# Altium project Grace.PrjPcb
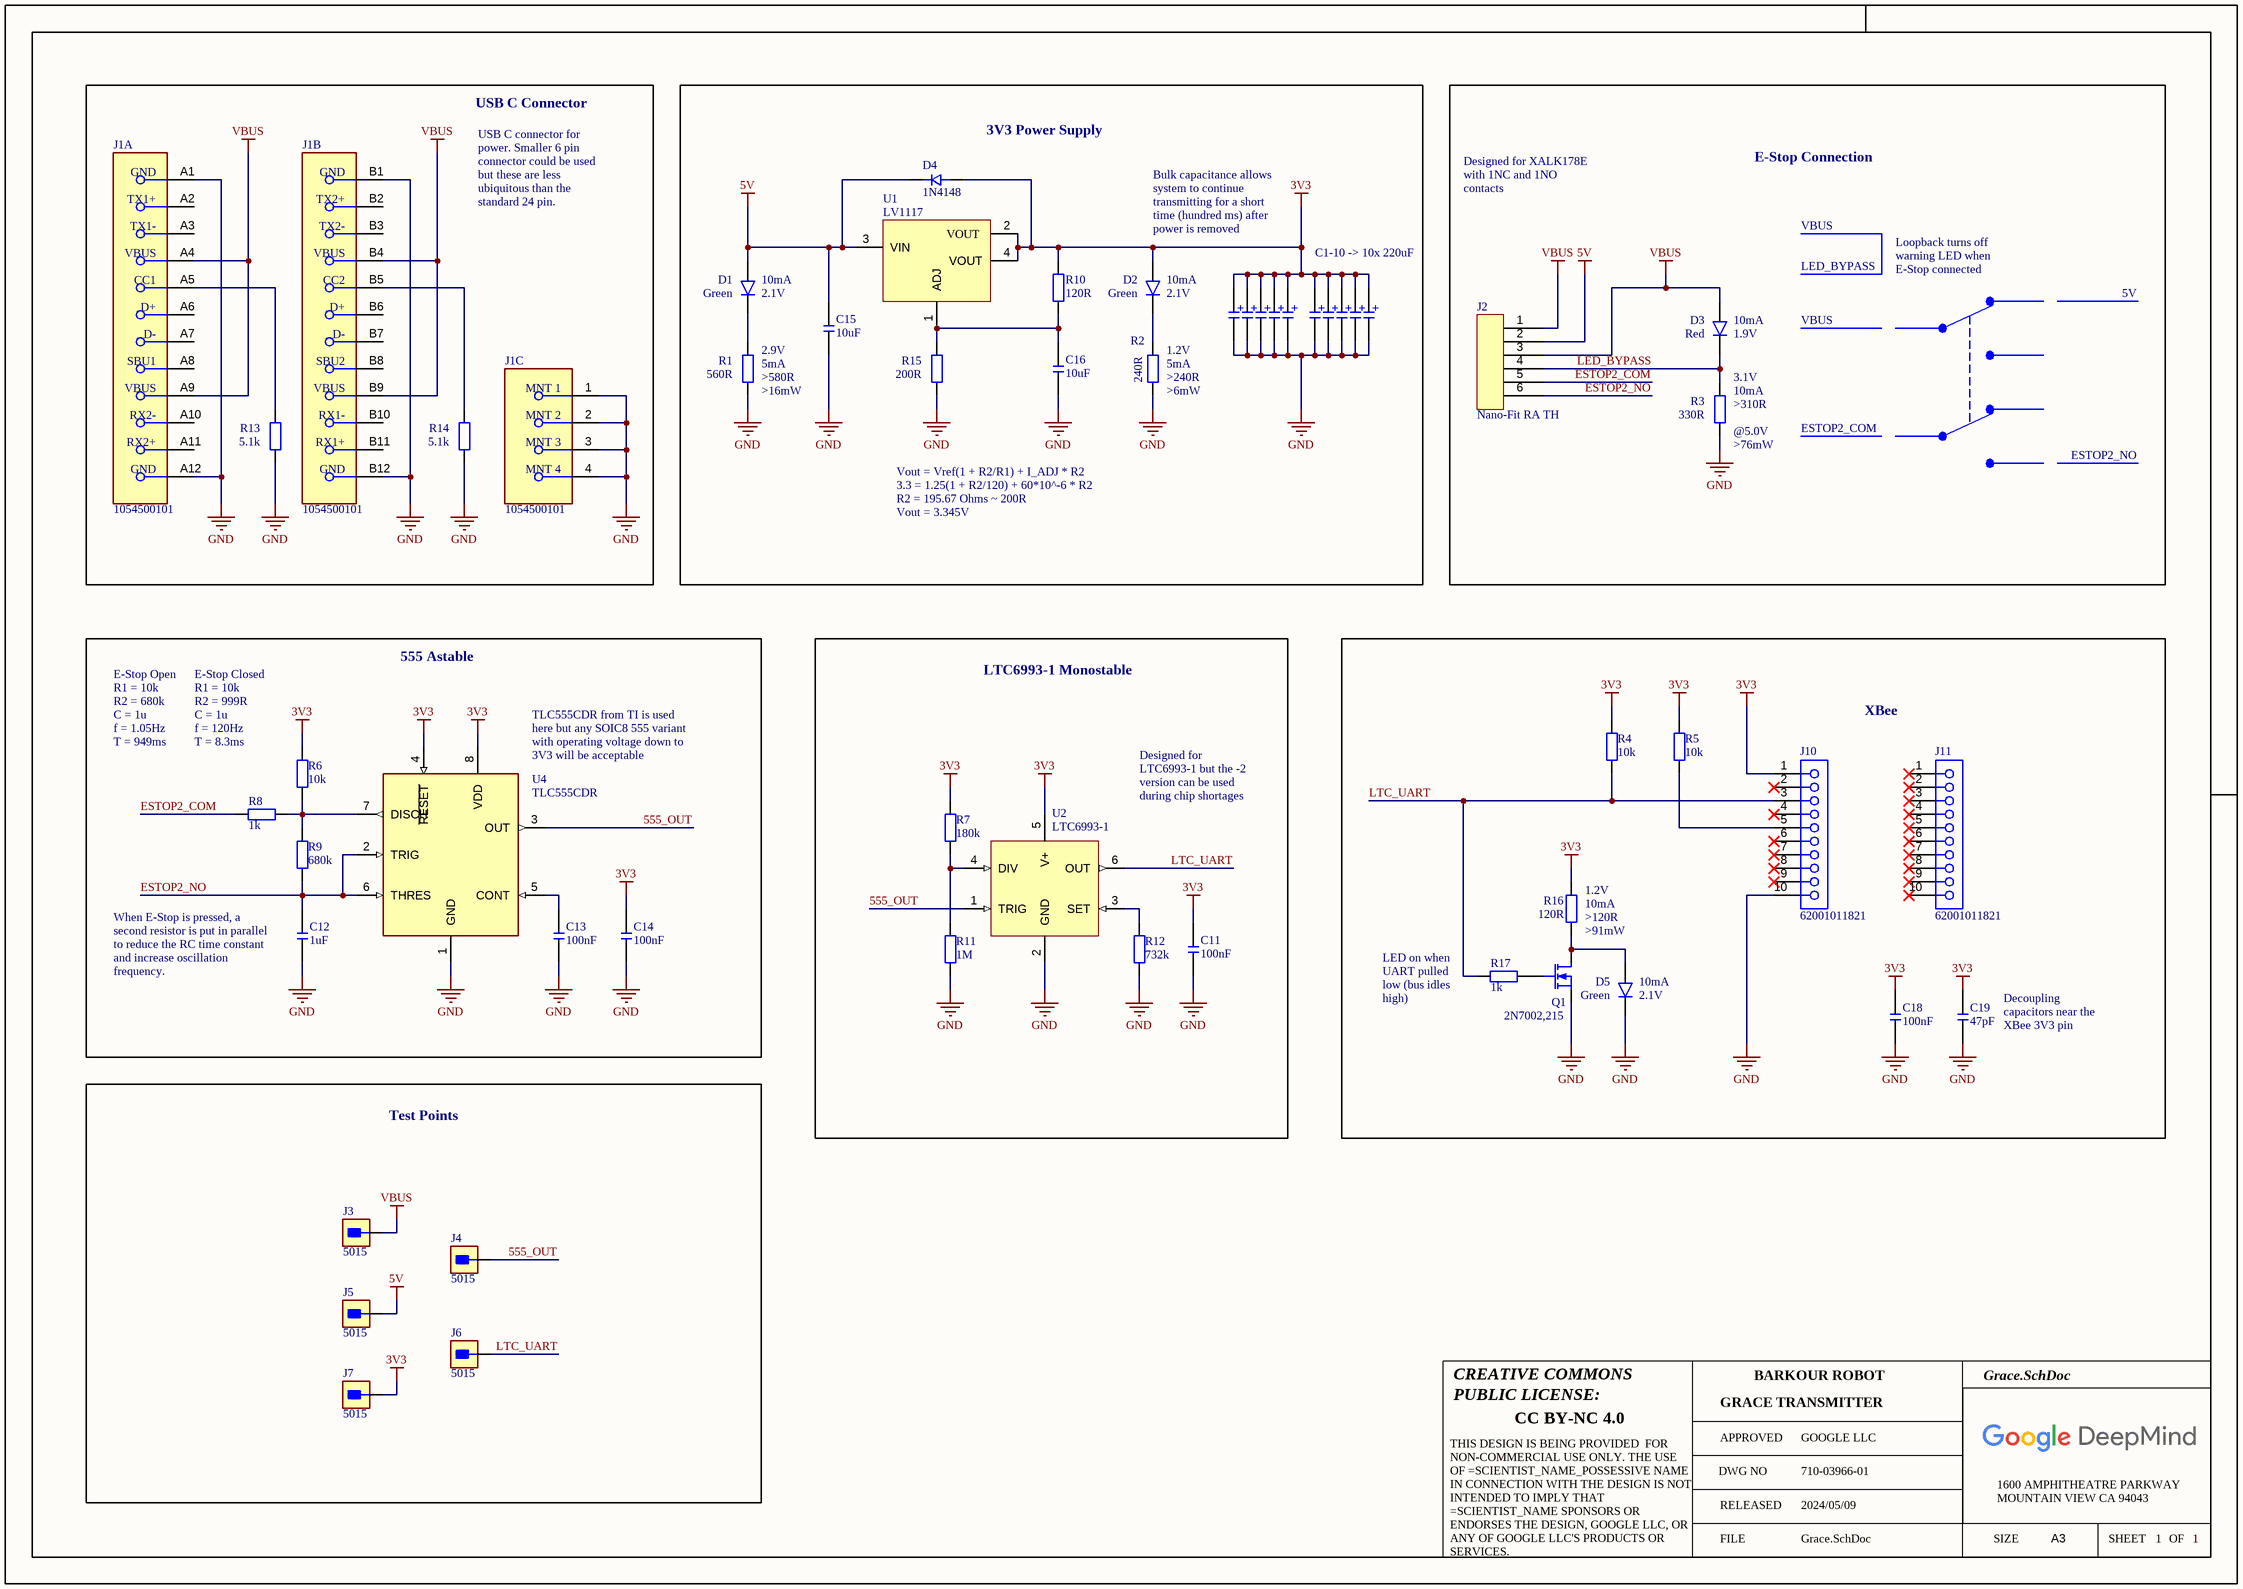
[diagram p0: Grace.SchDoc]
Scientist_Name_Possessive: GRACE HOPPER'S; Scientist_Name: GRACE HOPPER; PROJECT_NAME: GRACE TRANSMITTER; GPN_PCBA: 710-03966-01
1 sheet, 53 parts. Net scope: global (net labels, ports and power ports of the same name join across sheets).
Board file: Grace.PcbDoc

## Sheet Grace.SchDoc
size 420 x 297 mm; SheetNumber: 1; SheetTotal: 1

### Parts
C1  220uF  [CAP ALSMD 6.6MM H7.7MM]  (value not drawn)
C2  220uF  [CAP ALSMD 6.6MM H7.7MM]  (value not drawn)
C3  220uF  [CAP ALSMD 6.6MM H7.7MM]  (value not drawn)
C4  220uF  [CAP ALSMD 6.6MM H7.7MM]  (value not drawn)
C5  220uF  [CAP ALSMD 6.6MM H7.7MM]  (value not drawn)
C6  220uF  [CAP ALSMD 6.6MM H7.7MM]  (value not drawn)
C7  220uF  [CAP ALSMD 6.6MM H7.7MM]  (value not drawn)
C8  220uF  [CAP ALSMD 6.6MM H7.7MM]  (value not drawn)
C9  220uF  [CAP ALSMD 6.6MM H7.7MM]  (value not drawn)
C10  220uF  [CAP ALSMD 6.6MM H7.7MM]  (value not drawn)
C11  100nF  [CAP 0603_1608 RF]
C12  1uF  [CAP 0603_1608 RF]
C13  100nF  [CAP 0603_1608 RF]
C14  100nF  [CAP 0603_1608 RF]
C15  10uF  [CAP 1206_3216]
C16  10uF  [CAP 1206_3216]
C18  100nF  [CAP 0603_1608 RF]
C19  47pF  [CAP 0603_1608 RF]
D1  Forward Current: 10mA  Forward Voltage: 2.1V  Colour: Green  [LED TH 5mm]  (hidden comment: HLMP-3507)
D2  Forward Current: 10mA  Forward Voltage: 2.1V  Colour: Green  [LED TH 5mm]  (hidden comment: HLMP-3507)
D3  Forward Current: 10mA  Forward Voltage: 1.9V  Colour: Red  [LED TH 5mm]  (hidden comment: HLMP-3301)
D4  1N4148WS-7-F  [SOD323]  (value not drawn)
D5  Forward Current: 10mA  Forward Voltage: 2.1V  Colour: Green  [LED TH 5mm]  (hidden comment: HLMP-3507)
J1  1054500101  [Molex 1054500101 - With Model]  (parts A,B,C of 3)
J2  Colloquial: Nano-Fit RA TH  [MOLEX 1053131106]  (hidden comment: 105313-1206)
J3  5015  [FP-5015-MFG-RF]
J4  5015  [FP-5015-MFG-RF]
J5  5015  [FP-5015-MFG-RF]
J6  5015  [FP-5015-MFG-RF]
J7  5015  [FP-5015-MFG-RF]
J10  62001011821  [62001011821]
J11  62001011821  [62001011821]
Q1  2N7002,215  [NEXPERIA SOT-23-3]
R1  560R  [RES 0603_1608 RF]
R2  240R  [RES 0603_1608 RF]
R3  330R  [RES 0603_1608 RF]
R4  10k  [RES 0603_1608 RF]
R5  10k  [RES 0603_1608 RF]
R6  10k  [RES 0603_1608 RF]
R7  180k  [RES 0603_1608 RF]
R8  1k  [RES 0603_1608 RF]
R9  680k  [RES 0603_1608 RF]
R10  120R  [RES 1206_3216 RF]
R11  1M  [RES 0603_1608 RF]
R12  732k  [RES 0603_1608 RF]
R13  5.1k  [RES 0603_1608 RF]
R14  5.1k  [RES 0603_1608 RF]
R15  200R  [RES 1206_3216 RF]
R16  120R  [RES 1206_3216 RF]
R17  1k  [RES 0603_1608 RF]
U1  Colloquial: LV1117  [TI SOT-223 DCY]  (hidden comment: TLV1117CDCY)
U2  LTC6993CS6-1#TRMPBF  [LT TSOT-23-6 S6]  (value not drawn)
U4  TLC555CDR  [TI SOIC-8 D0008A]

### Blocks framed on the sheet
USB C Connector: J1 R13 R14
3V3 Power Supply: C1-C10 C15 C16 D1 D2 D4 R1 R2 R10 R15 U1
E-Stop Connection: D3 J2 R3
555 Astable: C12-C14 R6 R8 R9 U4
LTC6993-1 Monostable: C11 R7 R11 R12 U2
XBee: C18 C19 D5 J10 J11 Q1 R4 R5 R16 R17
Test Points: J3-J7

### Nets
3V3: C1.1 C2.1 C3.1 C4.1 C5.1 C6.1 C7.1 C8.1 C9.1 C10.1 C11.2 C14.2 C18.2 C19.2 D2.2(Anode) D4.1 J7.1 J10.1 R4.2 R5.2 R6.2 R7.2 R10.2 R16.2 U1.2(VOUT) U1.4(VOUT) U2.5(V+) U4.4(~{RESET}) U4.8(VDD)
5V: C15.2 D1.2(Anode) D4.2 J2.2 J5.1 U1.3(VIN)
GND: C1.2 C2.2 C3.2 C4.2 C5.2 C6.2 C7.2 C8.2 C9.2 C10.2 C11.1 C12.1 C13.1 C14.1 C15.1 C16.1 C18.1 C19.1 D5.1(Cathode) J1.1(MNT_1) J1.2(MNT_2) J1.3(MNT_3) J1.4(MNT_4) J1.A1(GND) J1.A12(GND) J1.B1(GND) J1.B12(GND) J10.10 Q1.2(S) R1.1 R2.1 R3.1 R11.1 R12.1 R13.1 R14.1 R15.1 U2.2(GND) U4.1(GND)
VBUS: D3.2(Anode) J1.A4(VBUS) J1.A9(VBUS) J1.B4(VBUS) J1.B9(VBUS) J2.1 J2.3 J3.1
555_OUT: J4.1 U2.1(TRIG) U4.3(OUT)
ESTOP2_COM: J2.5 R8.1
ESTOP2_NO: C12.2 J2.6 R9.1 U4.2(TRIG) U4.6(THRES)
LED_BYPASS: D3.1(Cathode) J2.4 R3.2
LTC_UART: J6.1 J10.3 R4.1 R17.1 U2.6(OUT)
NetC13_2: C13.2 U4.5(CONT)
NetC16_2: C16.2 R10.1 R15.2 U1.1(ADJ)
NetD1_1: D1.1(Cathode) R1.2
NetD2_1: D2.1(Cathode) R2.2
NetD5_2: D5.2(Anode) Q1.3(D) R16.1
NetJ1_A5: J1.A5(CC1) R13.2
NetJ1_B5: J1.B5(CC2) R14.2
NetJ10_5: J10.5 R5.1
NetQ1_1: Q1.1(G) R17.2
NetR6_1: R6.1 R8.2 R9.2 U4.7(DISCH)
NetR7_1: R7.1 R11.2 U2.4(DIV)
NetR12_2: R12.2 U2.3(SET)

Not connected (* = marked no-connect by the designer): J1 A2(TX1+) A3(TX1-) A6(D+) A7(D-) A8(SBU1) A10(RX2-) A11(RX2+) B2(TX2+) B3(TX2-) B6(D+) B7(D-) B8(SBU2) B10(RX1-) B11(RX1+); J10 2* 4* 6* 7* 8* 9*; J11 1* 2* 3* 4* 5* 6* 7* 8* 9* 10*

### Notes on the sheet
- Designed for XALK178E with 1NC and 1NO contacts
- USB C connector for power. Smaller 6 pin connector could be used but these are less ubiquitous than the standard 24 pin.
- Bulk capacitance allows system to continue transmitting for a short time (hundred ms) after power is removed
- C1-10 -> 10x 220uF
- VBUS
- LED_BYPASS
- Loopback turns off warning LED when E-Stop connected
- 5V
- (near C15) 2.9V
  5mA
  >580R
  >16mW
- 1.2V
  5mA
  >240R
  >6mW
- (near R3) 3.1V
  10mA
  >310R
- ESTOP2_COM
- ESTOP2_NO
- (near R3) @5.0V
  >76mW
- Vout = Vref(1 + R2/R1) + I_ADJ * R2
  3.3 = 1.25(1 + R2/120) + 60*10^-6 * R2
  R2 = 195.67 Ohms ~ 200R
  Vout = 3.345V
- E-Stop Open
  R1 = 10k
  R2 = 680k
  C = 1u
  f = 1.05Hz
  T = 949ms
- E-Stop Closed
  R1 = 10k
  R2 = 999R
  C = 1u
  f = 120Hz
  T = 8.3ms
- (near U4) TLC555CDR from TI is used here but any SOIC8 555 variant with operating voltage down to 3V3 will be acceptable
- Designed for LTC6993-1 but the -2 version can be used during chip shortages
- (near R16) 1.2V
  10mA
  >120R
  >91mW
- (near R17) LED on when UART pulled low (bus idles high)
- (near C12) When E-Stop is pressed, a second resistor is put in parallel to reduce the RC time constant and increase oscillation frequency.
- (near C19) Decoupling capacitors near the XBee 3V3 pin
- CREATIVE COMMONS
- PUBLIC LICENSE:
- BARKOUR ROBOT
- CC BY-NC 4.0
- APPROVED
- DWG NO
- GOOGLE LLC
- FILE
- RELEASED
- 2024/05/09
- SIZE
- 1600 AMPHITHEATRE PARKWAY
- MOUNTAIN VIEW CA 94043
- A3
- SHEET
- OF
- THIS DESIGN IS BEING PROVIDED  FOR NON-COMMERCIAL USE ONLY. THE USE OF =SCIENTIST_NAME_POSSESSIVE NAME IN CONNECTION WITH THE DESIGN IS NOT INTENDED TO IMPLY THAT =SCIENTIST_NAME SPONSORS OR ENDORSES THE DESIGN, GOOGLE LLC, OR ANY OF GOOGLE LLC'S PRODUCTS OR SERVICES.
- (in symbol C_POL) +

### Library data of the parts
C1-C10 = C_POL: Polarised Capacitor; Tolerance: 20%; Voltage Rating: 10V; Capacitance: 220uF; Diameter: 6.3mm; Height: 7.7mm
C11 C13 C14 C18 = C: Capacitor; Tolerance: 20%; Dielectric: X7R; Voltage Rating: 25V; Capacitance: 100nF; Size Code: 0603
C12 = C: Capacitor; Tolerance: 20%; Dielectric: X7R; Voltage Rating: 10V; Capacitance: 1uF; Size Code: 0603
C15 C16 = C: Generic Capacitor; Tolerance: 10%; Temperature Coefficient: X5R; Voltage Rating: 25V; Capacitance: 10uF; Size Code: 1206
C19 = C: Capacitor; Tolerance: 20%; Dielectric: C0G; Voltage Rating: 50V; Capacitance: 47pF; Size Code: 0603
D1 D2 D5 = LED_TH5_GREEN: Green 5mm TH LED, T-1 3/4, 10mA Ic, 2.1V; Wavelength: 569nm; Luminous Intensity: 4.7mcd; Case Size: 5mm; Manufacturer Part Number: HLMP-3507
D3 = LED_TH5_RED: Red 5mm TH LED, T-1 3/4, 10mA Ic, 1.9V; Wavelength: 626nm; Luminous Intensity: 6.1mcd; Case Size: 5mm; Manufacturer Part Number: HLMP-3301
D4 = 1N4148: Signal Diode VR=75V IF=150mA Trr=4ns P=200mW; Manufacturer: Diodes; Reverse Recovery Time: 4ns; Forward Voltage: 1.25V; Average Rectified Current: 150mA; Max Repetitive Reverse Voltage (Vrrm): 75V; Element Configuration: Single; Forward Current: 300mA; Peak Non-Repetitive Surge Current: 2A; Power Dissipation: 200mW; Max Reverse Current: 1uA; Polarity: Standard; Capacitance: 2pF; Supplier 1: RSComponents; Manufacturer Part Number: 1N4148WS-7-F; RoHS: Yes; Category: Rectifier Diodes; Stock 1: 18000; Pricing 1: 3000=0.03600, 6000=0.03200, 12000=0.02900, 30000=0.02700, 60000=0.02300 (USD); Mount: Surface Mount; Number of Pins: 2; Weight: 0.000173oz; Contact Plating: Tin,Matte; Min Operating Temperature: -65°C; Max Operating Temperature: 150°C; Packaging: Tape and Reel; Max Reverse Voltage (DC): 75V; Recovery Time: 4ns; Package Quantity: 3000; Max Forward Surge Current (Ifsm): 2A; Series: -; Max Surge Current: 2A; Current Rating: 150mA; Voltage Rating (DC): 75V; Output Current: 150mA; Reverse Recovery Time-Max: 4ns; Power Rating: 200mW; Voltage: 75V; Length: 1.8mm; Width: 1.4mm; Height: 1mm; Radiation Hardening: No; Lead Free: Lead Free; RoHS Compliant: Yes; REACH SVHC: No SVHC; Supplier Part Number 1: 9228070; Colloquial: 1N4148
J1 = 1054500101: Conn USB 3.1 Type C F 24 POS Solder RA SMD 24 Terminal 1 Port USB 3.1 T/R; Manufacturer: Molex; Number Of Contacts: 24; Voltage Rating: 30V; Shielding: true; Is Female: yes; Current Rating: 0.25/1.25/5A; Pitch: 0.5mm; Usb Standard: USB 3.1; Conn Orientation: Right Angle; Package: 0; Height: 3.44mm; Footprint Url: https://www.molex.com/pdm_docs/sd/1054500101_sd.pdf; Device Class L1: Connectors; Category: Conn; Device Class L2: USB Connectors; Digikey Description: CONN RCP USB3.1 TYPEC 24P SMD RA; Contact Material: Gold,Nickel; Mouser Description: USB Shielded I/O Receptacle; Type C; Right Angle; Surface Mount; Gold over Nickel; ComponentLink2Description: Datasheet; Lead Free: Yes; Automotive: No; Temperature Range High: +85°C; RoHS: TRUE; Octopart: https://octopart.com/105450-0101-molex-68082325; ComponentLink2URL: https://www.molex.com/webdocs/datasheets/pdf/en-us/1054500101_IO_CONNECTORS.pdf; Temperature: -30°C to +85°C; Temperature Range Low: -30°C; Device Class L3: unset; Manufacturer Part Number: 1054500101
J2 = Nano-Fit RA TH 6 Way Header: Nano-Fit Right Angle Header; Through Hole; 2.50mm; Single Row; 6 Circuit; Gold Plated; Manufacturer: Molex; Gender: Male; Supplier 1: RSComponents; Manufacturer Part Number: 105313-1206; RoHS: Yes; Category: Headers and Wire Housings; Stock 1: 621; Pricing 1: 10=1.38000 (GBP); Mount: Through Hole; Contact Plating: Gold; Contact Material: Brass; Color: Black; Termination: Through Hole; Number of Rows: 1; REACH SVHC: Unknown; RoHS Compliant: Yes; Supplier Part Number 1: 1225087
J3-J7 = 5015: PC TEST POINT MINIATURE; Manufacturer: keystone; Number Of Contacts: 1; Conn Orientation: Straight; Category: Conn; Manufacturer Part Number: 5015; Digikey Description: PC TEST POINT MINIATURE; Automotive: No; Lead Free: Yes; Octopart: https://octopart.com/5015-keystone-3822; ComponentLink2URL: http://www.keyelco.com/product-pdf.cfm?p=1353; Package: 5015; RoHS: TRUE; Device Class L3: unset; Device Class L2: unset; Contact Material: Silver; Device Class L1: Connectors; Height: 1.65mm; ComponentLink2Description: Datasheet
J10 J11 = CMP-1502-01210-2: NexarPartId: 65162168; Current Rating: 2A; Gender: Female; Operating Supply Voltage: 250V; Contact Resistance: 20mΩ; Number of Pins: 10; Orientation: Vertical; Lead Pitch: 2mm; RoHS: Non-Compliant
Q1 = 2N7002: MOSFET N-CH 60V 300MA SOT-23; Manufacturer: Nexperia; ComponentLink2URL: https://assets.nexperia.com/documents/data-sheet/BSS138PS.pdf?src-supplier=Digi-Key; ComponentLink2Description: https://assets.nexperia.com/documents/data-sheet/BSS138PS.pdf?src-supplier=Digi-Key; Supplier 1: Arrow Electronics; Manufacturer Part Number: 2N7002,215; RoHS: Yes; Category: MOSFETs; Stock 1: 243000; Pricing 1: 3000=0.05700, 9000=0.05640, 24000=0.05590, 45000=0.05530 (USD); RoHS Compliant: Yes; ComponentLink1URL: http://www.farnell.com/datasheets/1499179.pdf?src-supplier=Farnell; ComponentLink1Description: http://www.farnell.com/datasheets/1499179.pdf?src-supplier=Farnell; ComponentLink3URL: https://assets.nexperia.com/documents/data-sheet/2N7002.pdf?src-supplier=Digi-Key; ComponentLink3Description: https://assets.nexperia.com/documents/data-sheet/2N7002.pdf?src-supplier=Digi-Key; ComponentLink4URL: http://www.farnell.com/datasheets/1499179.pdf?src-supplier=Newark; ComponentLink4Description: http://www.farnell.com/datasheets/1499179.pdf?src-supplier=Newark; Supplier Part Number 1: 2N7002,215
R1-R9 R11-R14 R17 = R: Resistor; Tolerance: 1%; Voltage Rating: 75V; Power Rating: 100mW; Temperature Coefficient: 100ppm/°C; Size Code: 0603
  R1: Resistance: 560R
  R2: Resistance: 240R
  R3: Resistance: 330R
  R4-R6: Resistance: 10k
  R7: Resistance: 180k
  R8 R17: Resistance: 1k
  R9: Resistance: 680k
  R11: Resistance: 1M
  R12: Resistance: 732k
  R13 R14: Resistance: 5.1k
R10 R15 R16 = R: Resistor; Tolerance: 1%; Voltage Rating: 200V; Power Rating: 250mW; Temperature Coefficient: 100ppm/°C; Size Code: 1206
  R10 R16: Resistance: 120R
  R15: Resistance: 200R
U1 = TLV1117CDCY: LV1117 type LDO Regulator Pos 1.25V to 13.7V 0.8A 4-Pin(3+Tab) SOT-223 Tube; Manufacturer: Texas Instruments; Number of Outputs: 1; Max Input Voltage: 15V; Min Input Voltage: 2.7V; Output Voltage: 13.75V; Max Output Current: 800mA; Dropout Voltage: 1.2V; Input Bias Current: 5mA; Reference Voltage: 1.262V; Polarity: Positive; Min Output Voltage: 1.238V; Output Type: Adjustable; Supplier 1: Digi-Key; Manufacturer Part Number: TLV1117CDCY; RoHS: Yes; Category: Voltage Regulators - Linear; Stock 1: 1854; Pricing 1: 1=0.89000, 10=0.79400, 25=0.75400, 100=0.61930, 250=0.57888, 500=0.51156, 1000=0.40640 (USD); Mount: Surface Mount; Case/Package: SOT-223; Number of Pins: 4; Min Operating Temperature: -40°C; Max Operating Temperature: 125°C; Packaging: Rail/Tube; Output Current: 800mA; Package Quantity: 80; Number of Regulators: 1; Min Current Limit: 800mA; Quiescent Current: 5mA; Max Output Voltage: 13.7V; Series: -; Length: 6.5mm; Width: 3.5mm; Height: 1.6mm; Radiation Hardening: No; REACH SVHC: No SVHC; Lead Free: Lead Free; RoHS Compliant: Yes; ComponentLink1URL: https://datasheet.ciiva.com/27050/825601-27050234.pdf?src-supplier=Jameco; ComponentLink1Description: https://datasheet.ciiva.com/27050/825601-27050234.pdf?src-supplier=Jameco; ComponentLink2URL: https://datasheet.ciiva.com/15111/getdatasheetpartid-67440-15111324.pdf?src-supplier=Verical; ComponentLink2Description: https://datasheet.ciiva.com/15111/getdatasheetpartid-67440-15111324.pdf?src-supplier=Verical; ComponentLink3URL: https://datasheet.ciiva.com/2062/tlv1117-2062013.pdf?src-supplier=Digi-Key; ComponentLink3Description: https://datasheet.ciiva.com/2062/tlv1117-2062013.pdf?src-supplier=Digi-Key; ComponentLink4URL: https://datasheet.ciiva.com/14275/tlv1117-15-14275165.pdf?src-supplier=Avnet; ComponentLink4Description: https://datasheet.ciiva.com/14275/tlv1117-15-14275165.pdf?src-supplier=Avnet; Supplier Part Number 1: 296-26779-5-ND
U2 = LTC6993-1: TimerBlox: Monostable Pulse Generator (One Shot), 2.25 to 5.5 V, 0 to 70 degC, 6-Pin TSOT-23 (S6), RoHS, Tape and Reel; Manufacturer: Linear Technology; VSET: 0.97 to 1.03 V; RSET: 800 KOhm Max.; tWIDTH: 5 ns Typ.; Mounting Technology: Surface Mount; ComponentLink2Description: Datasheet; PackageDescription: 6-Pin Small Out-Line Transistor, Body 2.9 x 1.625 mm, Pitch 0.95 mm; ComponentLink1Description: Manufacturer URL; ComponentLink3URL: http://cds.linear.com/docs/en/packaging/SOT_6_05-08-1636.pdf; PackageVersion: Jun-10; ComponentLink1URL: http://www.linear.com/; DatasheetVersion: Rev. B; ComponentLink3Description: Package Specification; V+: 2.25 to 5.5 V; ComponentLink2URL: http://cds.linear.com/docs/en/datasheet/69931234fb.pdf; RoHS: TRUE; Temperature Range: 0 to 70 degC; PartNumber: LTC6993CS6-1#TRMPBF; Packing: Tape and Reel; Colloquial: LTC6993-1
U4 = TLC555CDR: 2.1-MHz, 250-µA, Low-Power Timer 8-SOIC 0 to 70; Min Supply Voltage: 2V; Number of Channels: 1; Frequency: 2.1MHz; Max Power Dissipation: 725mW; Max Supply Voltage: 15V; Low Level Output Current: 100mA; Current Rating: 250A; Quiescent Current: 250uA; Operating Supply Current: 360uA; High Level Output Current: -10mA; Width: 3.91mm; Case/Package: SOIC; Weight: 0.002561oz; Height: 1.58mm; Package Quantity: 2500; REACH SVHC: No SVHC; Number of Timers/Counters: 1; Lead Free: Lead Free; Number of Pins: 8; Max Operating Temperature: 125°C; Min Operating Temperature: -40°C; Length: 4.9mm; Radiation Hardening: No; Packaging: Tape and Reel; Termination: SMD/SMT; Mount: Surface Mount; Power Dissipation: 725mW; Supplier 1: Farnell; Supplier Part Number 1: 3121208